# Altium schematic sheet NetMY.SchDoc
size A4
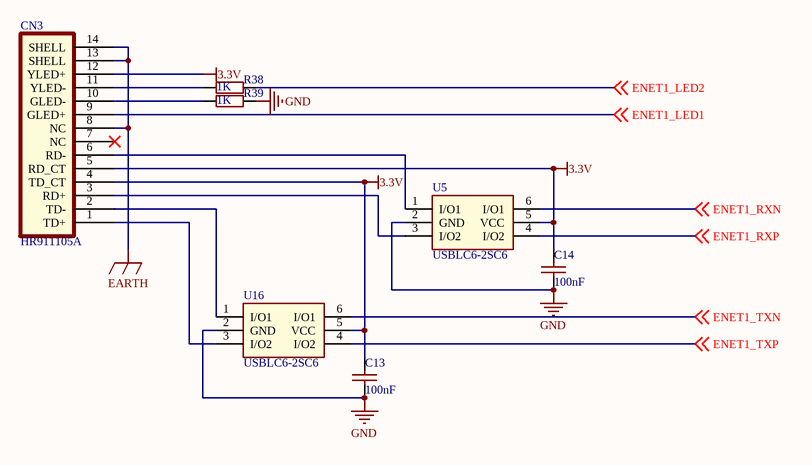
[diagram p0: NetMY.SchDoc]

## Parts
C13  100nF  [0805SMD_Cap]
C14  100nF  [0805SMD_Cap]
CN3  HR911105A  [RJ-45A12]
R38  1K  [0805_SMD_R]
R39  1K  [0805_SMD_R]
U5  USBLC6-2SC6  [SOT-23-6]
U16  USBLC6-2SC6  [SOT-23-6]

## Nets
3.3V: C13.2 C14.2 CN3.4(TD_CT) CN3.5(RD_CT) CN3.12(YLED+) U5.5(VCC) U16.5(VCC)
EARTH: CN3.8(NC) CN3.13(SHELL) CN3.14(SHELL)
GND: C13.1 C14.1 R39.2 U5.2(GND) U16.2(GND)
ENET1_LED1: CN3.9(GLED+) ; off-sheet ENET1_LED1
ENET1_LED2: R38.2 ; off-sheet ENET1_LED2
ENET1_RXN: U5.6(I/O1) ; off-sheet ENET1_RXN
ENET1_RXP: U5.4(I/O2) ; off-sheet ENET1_RXP
ENET1_TXN: U16.6(I/O1) ; off-sheet ENET1_TXN
ENET1_TXP: U16.4(I/O2) ; off-sheet ENET1_TXP
NetCN3_1: CN3.1(TD+) U16.3(I/O2)
NetCN3_2: CN3.2(TD-) U16.1(I/O1)
NetCN3_3: CN3.3(RD+) U5.3(I/O2)
NetCN3_6: CN3.6(RD-) U5.1(I/O1)
NetCN3_10: CN3.10(GLED-) R39.1
NetCN3_11: CN3.11(YLED-) R38.1

Not connected (* = marked no-connect by the designer): CN3 7(NC)*

## Library data of the parts
C13 C14 = SMD_Cap: 贴片电容; 研究所: 贴装电容_0805_4700pF; 松下: GR21BB1H472K
R38 R39 = SMD_0805: 贴片电阻; 松下: RS05K101FT; 松下: RS05000FT; 松下: RS05K3321FT; 松下: RS05K6811FT; 松下: RS05K102FT; 松下: RS05K2211FT; 松下: RS05K103FT; 松下: RS05K5111FT; 松下: RS05K5110FT; 松下: RS05K5112FT; 松下: RS05K8251FT; 松下: RS05K2212FT; 松下: RS05K104FT; 松下: RS05K5113FT; 松下: RS05K105FT; 松下: RS05L106FT; 研究所: 贴装电阻_0805_0_F1%; 研究所: 贴装电阻_0805_100_F1%; 研究所: 贴装电阻_0805_51.1K_F1%; 研究所: 贴装电阻_0805_1K_F1%; 研究所: 贴装电阻_0805_2.21K_F1%; 研究所: 贴装电阻_0805_3.32K_F1%; 研究所: 贴装电阻_0805_5.11K_F1%; 研究所: 贴装电阻_0805_511K_F1%; 研究所: 贴装电阻_0805_6.81K_F1%; 研究所: 贴装电阻_0805_511_F1%; 研究所: 贴装电阻_0805_8.25K_F1%; 研究所: 贴装电阻_0805_10K_F1%; 研究所: 贴装电阻_0805_22.1K_F1%; 研究所: 贴装电阻_0805_100K_F1%; 研究所: 贴装电阻_0805_1M_F1%; 研究所: 贴装电阻_0805_10M_F1%